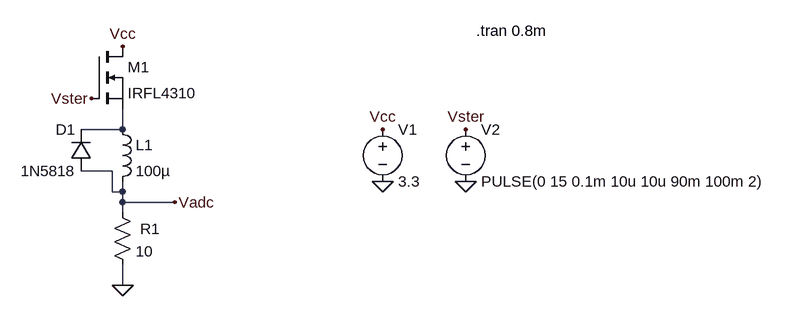
[diagram p0: schematic Draft1.asc]
Draft1.asc, the LTspice schematic file:
Version 4.1
SHEET 1 1116 680
WIRE 96 80 96 48
WIRE 96 80 32 80
WIRE 80 144 32 144
WIRE 80 176 80 144
WIRE 96 176 96 160
WIRE 96 176 80 176
WIRE 96 192 96 176
WIRE 176 192 96 192
WIRE 96 208 96 192
WIRE 96 320 96 288
FLAG 496 80 Vcc
FLAG 96 -48 Vcc
FLAG 624 80 Vster
FLAG 48 32 Vster
FLAG 496 160 0
FLAG 624 160 0
FLAG 176 192 Vadc
FLAG 96 320 0
SYMBOL res 80 192 R0
WINDOW 0 43 41 Left 2
SYMATTR InstName R1
SYMATTR Value 10
SYMATTR SpiceLine tol=0.1 pwr=0.25
SYMBOL nmos 48 -48 R0
SYMATTR InstName M1
SYMATTR Value IRFL4310
SYMBOL voltage 496 64 R0
WINDOW 123 0 0 Left 0
WINDOW 39 0 0 Left 0
SYMATTR InstName V1
SYMATTR Value 3.3
SYMBOL voltage 624 64 R0
WINDOW 123 0 0 Left 0
WINDOW 39 0 0 Left 0
SYMATTR InstName V2
SYMATTR Value PULSE(0 15 0.1m 10u 10u 90m 100m 2)
SYMBOL ind 80 64 R0
SYMATTR InstName L1
SYMATTR Value 100µ
SYMATTR SpiceLine Ipk=70 Rser=0.00095 Rpar=390 Cpar=5.277p
SYMBOL diode 48 144 R180
WINDOW 0 24 64 Left 2
WINDOW 3 24 0 Left 2
SYMATTR InstName D1
SYMATTR Value 1N5818
SYMATTR Description Diode
SYMATTR Type diode
TEXT 640 -72 Left 2 !.tran 0.8m

The netlist it stands for:
* Draft1.asc
R1 Vadc 0 10 tol=0.1 pwr=0.25
M1 Vcc Vster N001 N001 IRFL4310
V1 Vcc 0 3.3
V2 Vster 0 PULSE(0 15 0.1m 10u 10u 90m 100m 2)
L1 N001 Vadc 100µ Ipk=70 Rser=0.00095 Rpar=390 Cpar=5.277p
D1 Vadc N001 1N5818
.model D D
.lib standard.dio
.model NMOS NMOS
.model PMOS PMOS
.lib standard.mos
.tran 0.8m
.backanno
.end